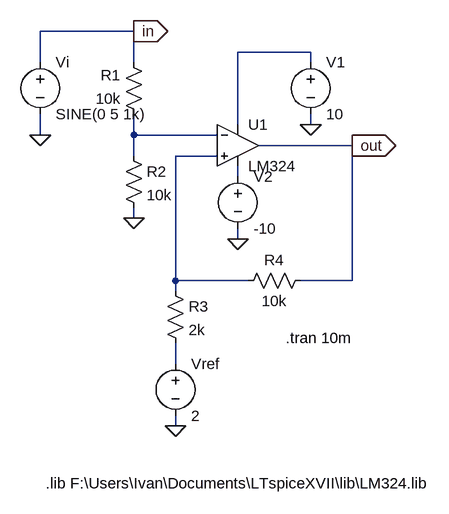
[diagram p0: schematic TP1-Circ4.asc]
TP1-Circ4.asc, the LTspice schematic file:
Version 4
SHEET 1 888 856
WIRE 80 144 -64 144
WIRE 352 176 240 176
WIRE -64 192 -64 144
WIRE 80 192 80 144
WIRE 352 192 352 176
WIRE 240 288 240 176
WIRE 352 288 352 272
WIRE -64 304 -64 272
WIRE 80 304 80 272
WIRE 208 304 80 304
WIRE 416 320 272 320
WIRE 80 336 80 304
WIRE 208 336 144 336
WIRE 240 368 240 352
WIRE 80 432 80 416
WIRE 240 464 240 448
WIRE 144 528 144 336
WIRE 256 528 144 528
WIRE 416 528 416 320
WIRE 416 528 336 528
WIRE 144 544 144 528
WIRE 144 656 144 624
WIRE 144 752 144 736
FLAG 240 464 0
FLAG 352 288 0
FLAG 80 432 0
FLAG -64 304 0
FLAG 144 752 0
FLAG 416 320 out
IOPIN 416 320 Out
FLAG 80 144 in
IOPIN 80 144 Out
SYMBOL res 96 288 R180
WINDOW 0 36 76 Left 2
WINDOW 3 36 40 Left 2
SYMATTR InstName R1
SYMATTR Value 10k
SYMBOL voltage 352 176 R0
WINDOW 123 0 0 Left 0
WINDOW 39 0 0 Left 0
SYMATTR InstName V1
SYMATTR Value 10
SYMBOL voltage 240 352 R0
WINDOW 123 0 0 Left 0
WINDOW 39 0 0 Left 0
SYMATTR InstName V2
SYMATTR Value -10
SYMBOL OpAmps\\LM324 240 320 R0
SYMATTR InstName U1
SYMBOL res 64 320 R0
SYMATTR InstName R2
SYMATTR Value 10k
SYMBOL res 128 528 R0
SYMATTR InstName R3
SYMATTR Value 2k
SYMBOL voltage -64 176 R0
WINDOW 123 0 0 Left 0
WINDOW 39 0 0 Left 0
SYMATTR InstName Vi
SYMATTR Value SINE(0 5 1k)
SYMBOL res 352 512 R90
WINDOW 0 0 56 VBottom 2
WINDOW 3 32 56 VTop 2
SYMATTR InstName R4
SYMATTR Value 10k
SYMBOL voltage 144 640 R0
WINDOW 123 0 0 Left 0
WINDOW 39 0 0 Left 0
SYMATTR InstName Vref
SYMATTR Value 2
TEXT -56 840 Left 2 !.lib F:\\Users\\Ivan\\Documents\\LTspiceXVII\\lib\\LM324.lib
TEXT 416 616 Right 2 !.tran 10m

The netlist it stands for:
* TP1-Circ4.asc
R1 N002 in 10k
V1 N001 0 10
V2 N004 0 -10
* U1: LM324 (symbol OpAmps\LM324 not available, pins judged from their places): In+=N003 In-=N002 V+=N001 V-=N004 OUT=out
R2 N002 0 10k
R3 N003 N005 2k
Vi in 0 SINE(0 5 1k)
R4 out N003 10k
Vref N005 0 2
.lib F:\Users\Ivan\Documents\LTspiceXVII\lib\LM324.lib
.tran 10m
.backanno
.end